# EAGLE design LaunchPadMikroBUS (EAGLE 6.4)
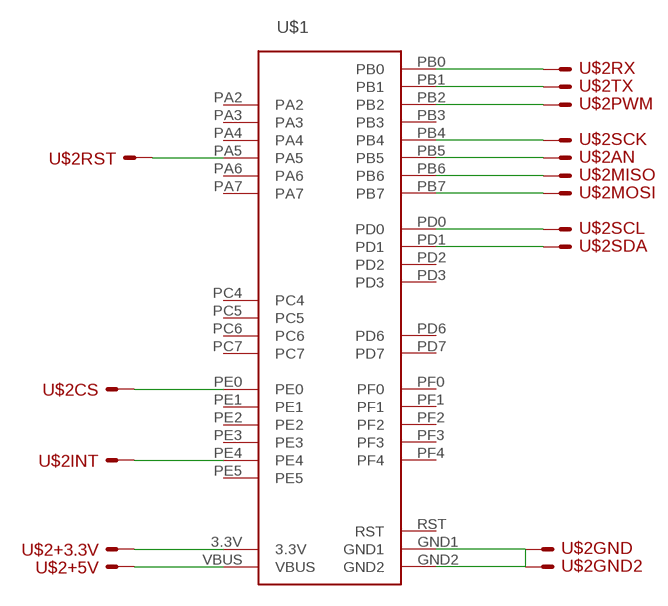
[diagram p0: schematic, sheet 1]

## Parts
U$1  STELLARIS-LAUNCHPADSTELLARIS-LAUNCHPAD-XL  [LAUNCHPAD-XL]
U$2  MIKROBUS  [MIKROBUS]

## Nets
N$1: U$1.PB2 U$2.PWM
N$2: U$1.PE4 U$2.INT
N$3: U$1.PB0 U$2.RX
N$4: U$1.PB1 U$2.TX
N$5: U$1.PD0 U$2.SCL
N$6: U$1.PD1 U$2.SDA
N$7: U$1.VBUS U$2.+5V
N$9: U$1.GND1 U$1.GND2 U$2.GND U$2.GND2
N$10: U$1.3.3V U$2.+3.3V
N$11: U$1.PB5 U$2.AN
N$12: U$1.PA5 U$2.RST
N$13: U$1.PE0 U$2.CS
N$14: U$1.PB4 U$2.SCK
N$15: U$1.PB7 U$2.MOSI
N$16: U$1.PB6 U$2.MISO
Unconnected: U$1.PA2 U$1.PA3 U$1.PA4 U$1.PA6 U$1.PA7 U$1.PB3 U$1.PC4 U$1.PC5 U$1.PC6 U$1.PC7 U$1.PD2 U$1.PD3 U$1.PD6 U$1.PD7 U$1.PE1 U$1.PE2 U$1.PE3 U$1.PE5 U$1.PF0 U$1.PF1 U$1.PF2 U$1.PF3 U$1.PF4

## Power pins joined to a net without a drawn wire
RST: U$1.RST

## Library data of the parts
U$1 = StellarisLaunchPad_Fred:STELLARIS-LAUNCHPAD
U$2 = lieven:MIKROBUS

## Board
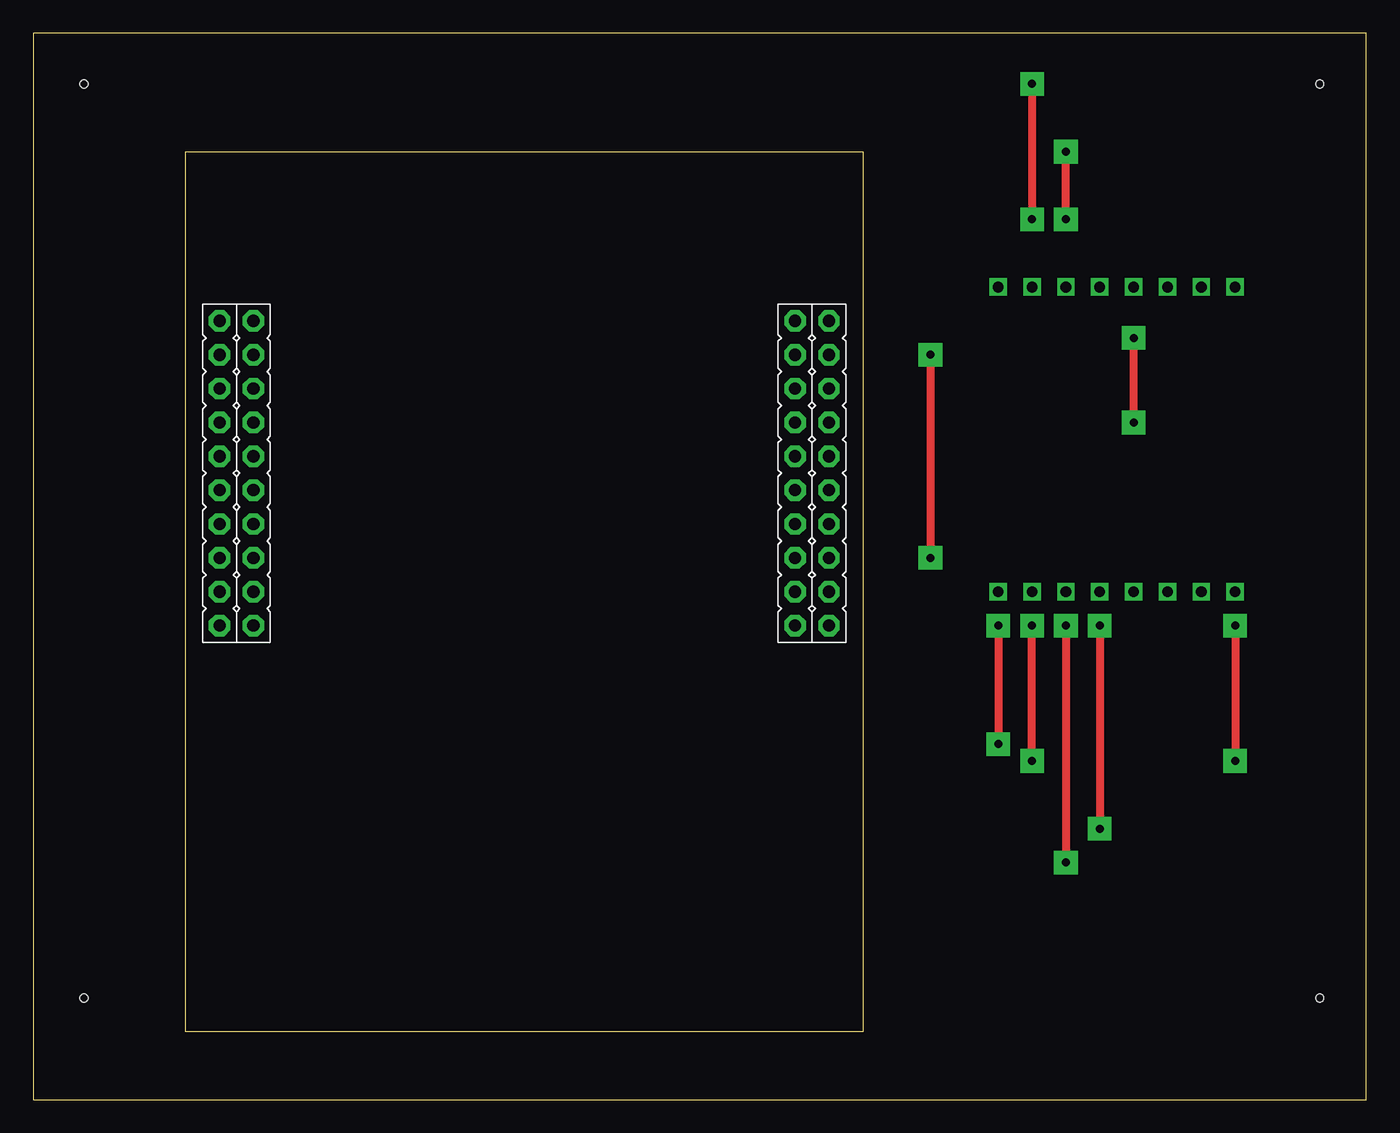
[diagram p1: board, top side]
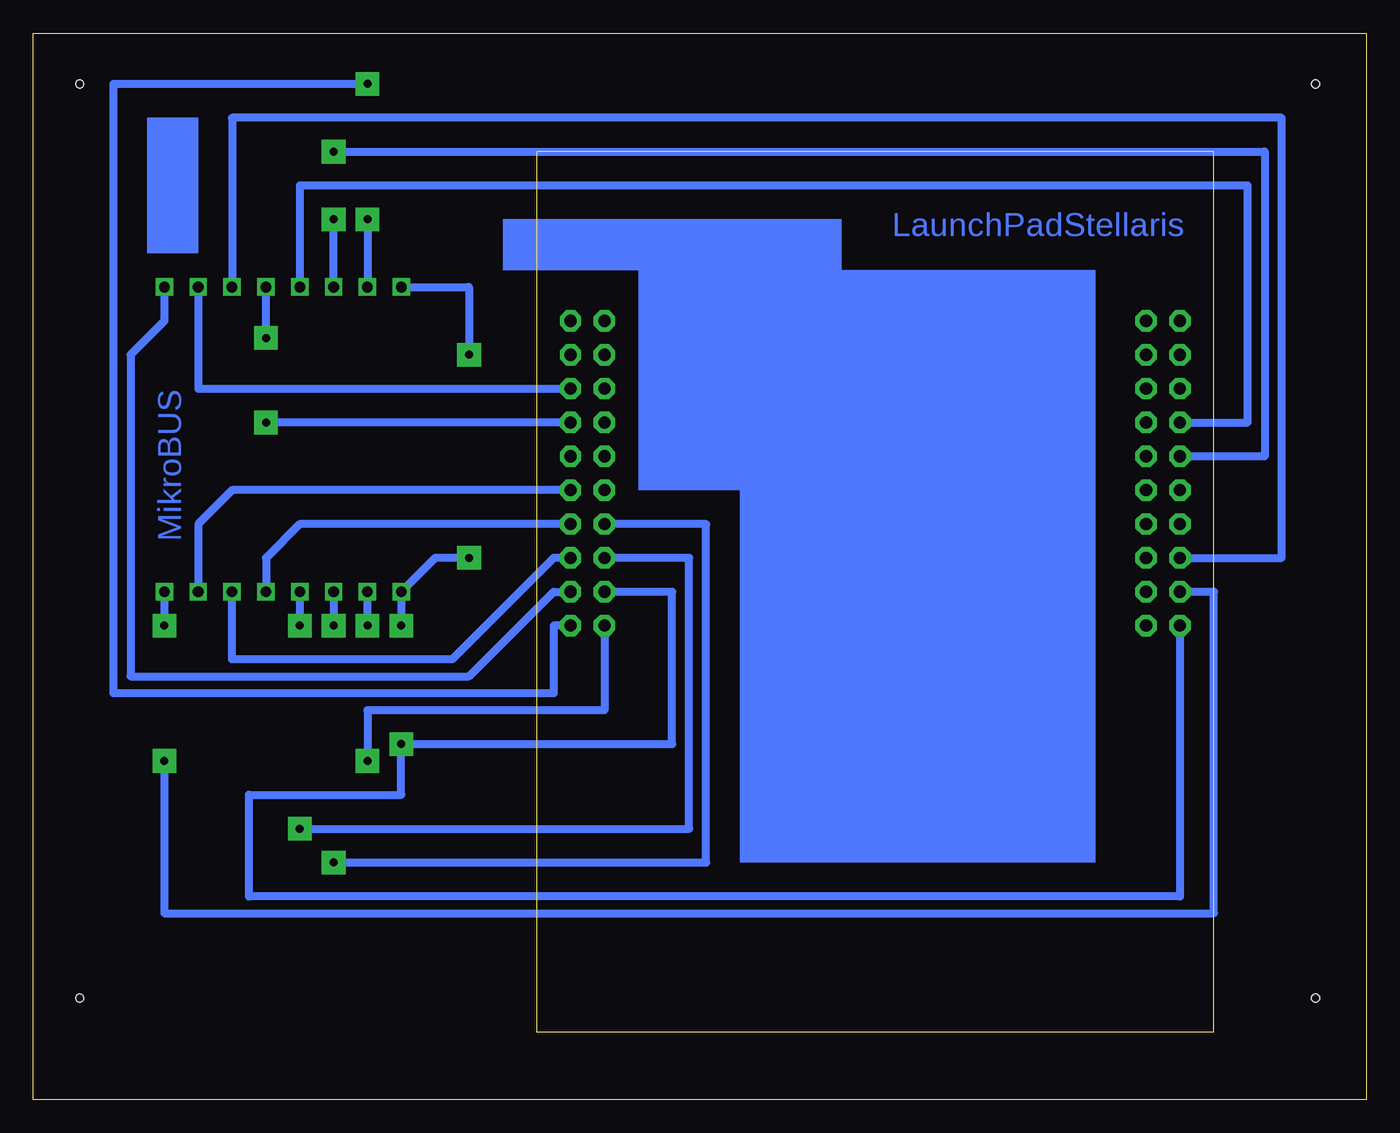
[diagram p2: board, bottom side, seen from below]

Size 100 x 80 mm. Coordinates in mm from the lower left corner, seen from the top.
Outline: 0,0 100,0 100,80 0,80 0,0
Copper layers (1*16): Top 0.035mm / dielectric 1.5mm / Bottom 0.035mm
Design rules "default": minimum track width 10mil, minimum drill 24mil, track to track 8mil, track to pad 8mil, pad to pad 8mil, via to via 8mil, smd to smd 8mil, copper to edge 40mil, drill to drill 8mil, minimum pad ring 10mil, minimum via ring 8mil, stop-mask expansion 4mil, vias tented up to drill 0mil, thermal gap 10mil
Holes 0.6 mm at 3.81,76.2 96.52,76.2 96.52,7.62 3.81,7.62

### Footprints (pad centres in the part's own frame; a part is rotated, then mirrored left to right if it is on the bottom)
LAUNCHPAD-XL = drill 0.914 pad 1.6 octagon: 3.3V 30.48,2.54; GND1 33.02,5.08; GND2 30.48,48.26; PA2 53.34,48.26; PA3 50.8,48.26; PA4 48.26,48.26; PA5 48.26,2.54; PA6 50.8,2.54; PA7 53.34,2.54; PB0 35.56,2.54; PB1 38.1,2.54; PB2 33.02,48.26; PB3 35.56,45.72; PB4 45.72,2.54; PB5 33.02,2.54; PB6 45.72,48.26; PB7 43.18,48.26; PC4 38.1,45.72; PC5 40.64,45.72; PC6 43.18,45.72; PC7 45.72,45.72; PD0 35.56,5.08; PD1 38.1,5.08; PD2 40.64,5.08; PD3 43.18,5.08; PD6 48.26,45.72; PD7 50.8,45.72; PE0 35.56,48.26; PE1 45.72,5.08; PE2 48.26,5.08; PE3 50.8,5.08; PE4 40.64,2.54; PE5 43.18,2.54; PF0 38.1,48.26; PF1 53.34,5.08; PF2 30.48,45.72; PF3 33.02,45.72; PF4 53.34,45.72; RST 40.64,48.26; VBUS 30.48,5.08
MIKROBUS = drill 0.8 square: +3.3V 0,2.54; +5V 22.86,2.54; AN 0,17.78; CS 0,12.7; GND 0,0; GND2 22.86,0; INT 22.86,15.24; MISO 0,7.62; MOSI 0,5.08; PWM 22.86,17.78; RST 0,15.24; RX 22.86,12.7; SCK 0,10.16; SCL 22.86,7.62; SDA 22.86,5.08; TX 22.86,10.16

### Placement (x,y rotation side)
U$1  62.23,5.08 90 top
U$2  72.39,60.96 270 top

### Tracks (layer width: path | path; a pad name or v marks a point on that pad's centre or on a via)
N$1  (via drill 0.6 pad 1.78)
  Top 0.61: v90.17,35.56 v90.17,25.4
  Bottom 0.61: U$2.PWM v90.17,35.56 | v90.17,25.4 90.17,13.97 11.43,13.97 11.43,38.1 U$1.PB2
N$2
  Bottom 0.61: U$1.PE4 85.09,45.72 87.63,43.18 U$2.INT
N$3
  Bottom 0.61: U$1.PB0 60.96,40.64 68.58,33.02 85.09,33.02 U$2.RX
N$4
  Bottom 0.61: U$1.PB1 80.01,43.18 82.55,40.64 U$2.TX
N$5  (via drill 0.6 pad 1.78)
  Top 0.61: v80.01,35.56 v80.01,20.32
  Bottom 0.61: U$2.SCL v80.01,35.56 | v80.01,20.32 50.8,20.32 50.8,40.64 U$1.PD0
N$6  (via drill 0.6 pad 1.78)
  Top 0.61: v77.47,35.56 v77.47,17.78
  Bottom 0.61: U$2.SDA v77.47,35.56 | v77.47,17.78 49.53,17.78 49.53,43.18 U$1.PD1
N$7  (via drill 0.6 pad 1.78)
  Top 0.61: v74.93,25.4 v74.93,35.56
  Bottom 0.61: U$1.VBUS 57.15,29.21 74.93,29.21 v74.93,25.4 | v74.93,35.56 U$2.+5V
N$9  (via drill 0.6 pad 1.78)
  Top 0.61: v72.39,35.56 v72.39,26.67 | v67.31,55.88 v67.31,40.64
  Bottom 0.61: U$1.GND2 13.97,15.24 83.82,15.24 83.82,22.86 72.39,22.86 v72.39,26.67 52.07,26.67 52.07,38.1 U$1.GND1 | v72.39,35.56 U$2.GND2 69.85,40.64 v67.31,40.64 | U$2.GND 67.31,60.96 v67.31,55.88
N$10  (via drill 0.6 pad 1.78)
  Top 0.61: v74.93,76.2 v74.93,66.04
  Bottom 0.61: U$1.3.3V 60.96,35.56 60.96,30.48 93.98,30.48 93.98,76.2 v74.93,76.2 | v74.93,66.04 U$2.+3.3V
N$11
  Bottom 0.61: U$2.AN 90.17,58.42 92.71,55.88 92.71,31.75 67.31,31.75 60.96,38.1 U$1.PB5
N$12
  Bottom 0.61: U$2.RST 87.63,53.34 U$1.PA5
N$13
  Bottom 0.61: U$1.PE0 6.35,40.64 6.35,73.66 85.09,73.66 U$2.CS
N$14  (via drill 0.6 pad 1.78)
  Top 0.61: v82.55,50.8 v82.55,57.15
  Bottom 0.61: U$1.PB4 v82.55,50.8 | v82.55,57.15 U$2.SCK
N$15  (via drill 0.6 pad 1.78)
  Top 0.61: v77.47,66.04 v77.47,71.12
  Bottom 0.61: U$2.MOSI v77.47,66.04 | v77.47,71.12 7.62,71.12 7.62,48.26 U$1.PB7
N$16
  Bottom 0.61: U$1.PB6 8.89,50.8 8.89,68.58 80.01,68.58 U$2.MISO
(copper drawn outside any net)
  shapes: Bottom area x4

### Text on the board
Bottom: LaunchPadStellaris | MikroBUS